# EAGLE schematic Rpi_Interface (EAGLE 9.6.2)
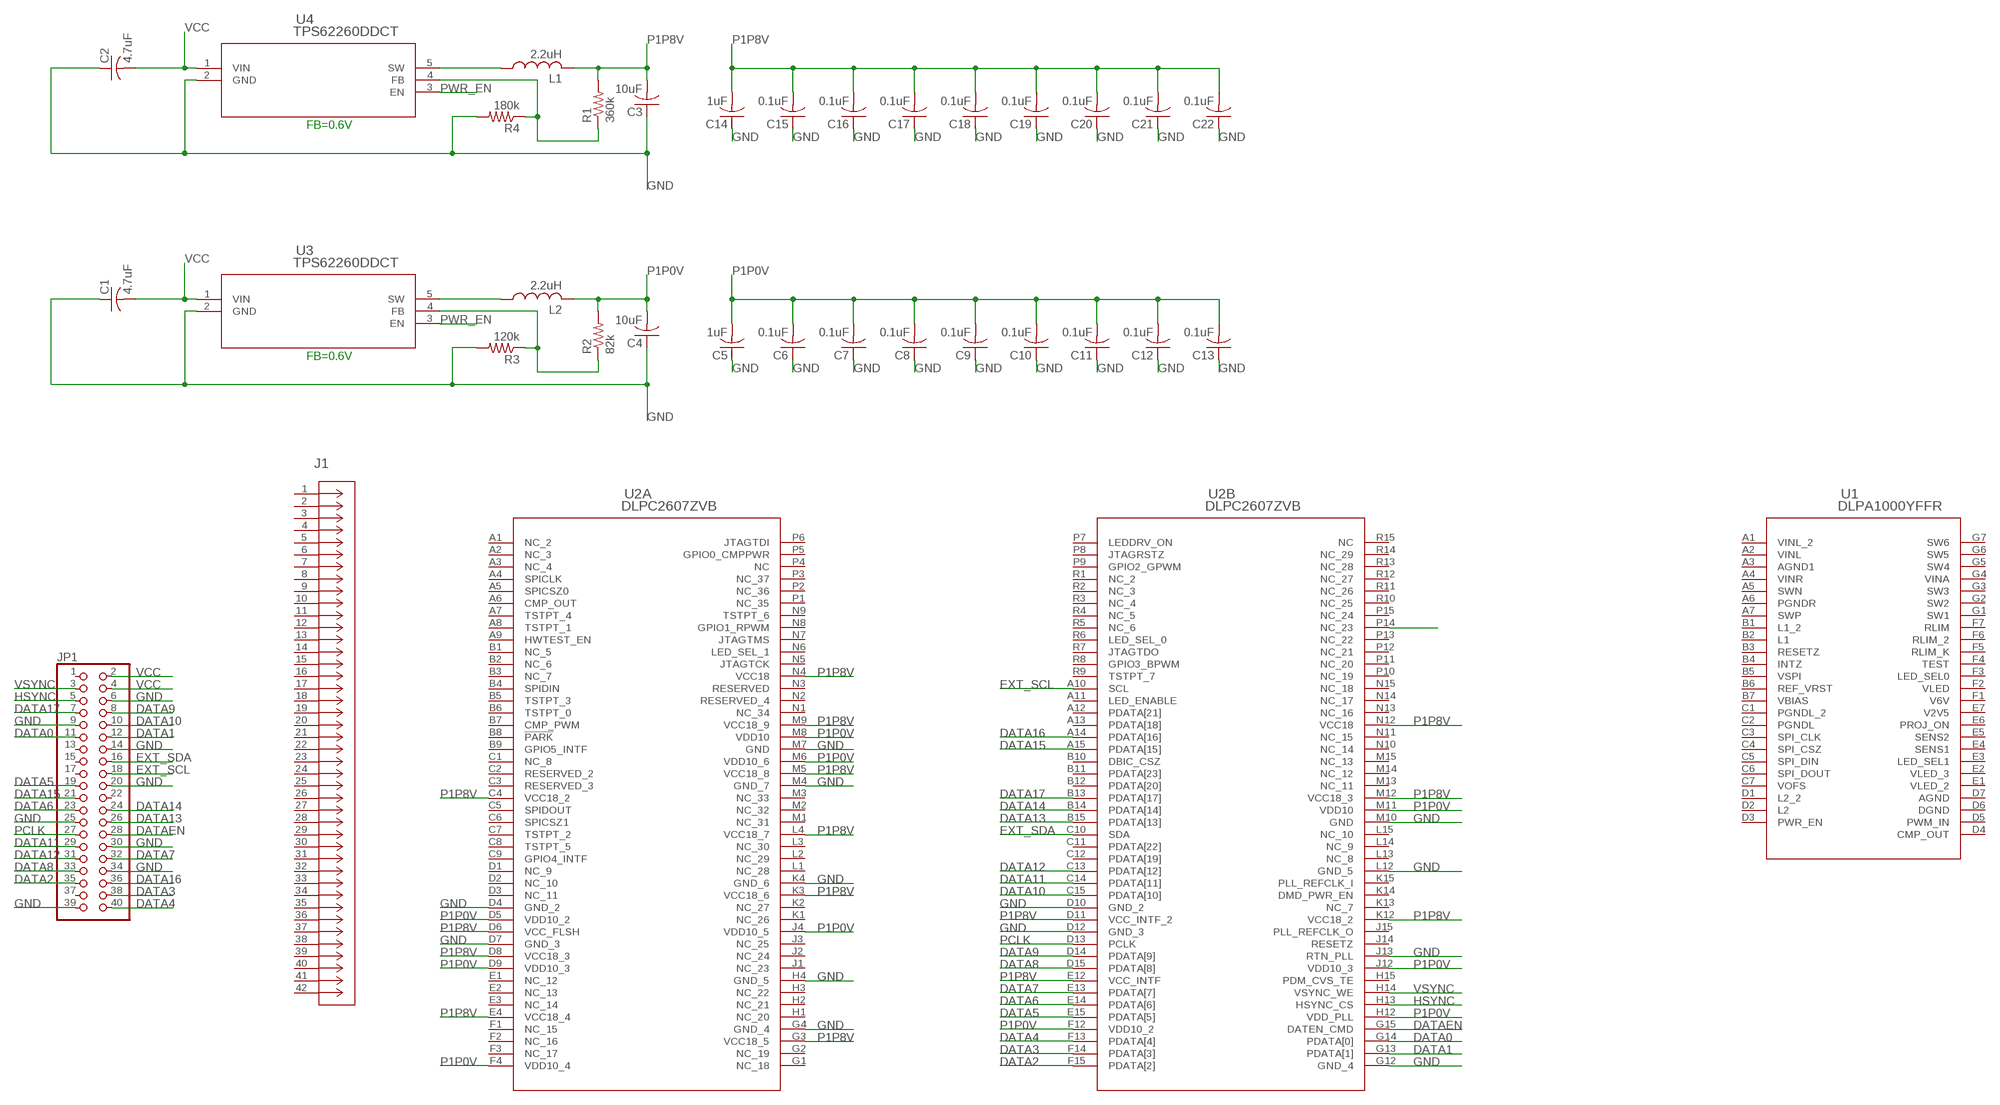
[diagram p0: schematic, sheet 1]

## Parts
C1  4.7uF  C-USC0201  [C0201]
C2  4.7uF  C-USC0201  [C0201]
C3  10uF  C-USC0201  [C0201]
C4  10uF  C-USC0201  [C0201]
C5  1uF  C-USC0201  [C0201]
C6  0.1uF  C-USC0201  [C0201]
C7  0.1uF  C-USC0201  [C0201]
C8  0.1uF  C-USC0201  [C0201]
C9  0.1uF  C-USC0201  [C0201]
C10  0.1uF  C-USC0201  [C0201]
C11  0.1uF  C-USC0201  [C0201]
C12  0.1uF  C-USC0201  [C0201]
C13  0.1uF  C-USC0201  [C0201]
C14  1uF  C-USC0201  [C0201]
C15  0.1uF  C-USC0201  [C0201]
C16  0.1uF  C-USC0201  [C0201]
C17  0.1uF  C-USC0201  [C0201]
C18  0.1uF  C-USC0201  [C0201]
C19  0.1uF  C-USC0201  [C0201]
C20  0.1uF  C-USC0201  [C0201]
C21  0.1uF  C-USC0201  [C0201]
C22  0.1uF  C-USC0201  [C0201]
J1  AXT642124DD1  [CONN_AXT642124_PAN]
JP1  PINHD-2X20  [2X20]
L1  2.2uH  L-USL0201  [L0201]
L2  2.2uH  L-USL0201  [L0201]
R1  360k  R-US_0204/2V  [0204V]
R2  82k  R-US_0204/2V  [0204V]
R3  120k  R-US_0204/2V  [0204V]
R4  180k  R-US_0204/2V  [0204V]
U1  DLPA1000YFFR  [YFF49_TEX]
U2  DLPC2607ZVB  [ZVB176_TEX]
U3  TPS62260DDCT  [DDC5]
U4  TPS62260DDCT  [DDC5]

## Nets
DATA0: JP1.11 U2.G14(B:PDATA[0])
DATA1: JP1.12 U2.G13(B:PDATA[1])
DATA2: JP1.35 U2.F15(B:PDATA[2])
DATA3: JP1.38 U2.F14(B:PDATA[3])
DATA4: JP1.40 U2.F13(B:PDATA[4])
DATA5: JP1.19 U2.E15(B:PDATA[5])
DATA6: JP1.23 U2.E14(B:PDATA[6])
DATA7: JP1.32 U2.E13(B:PDATA[7])
DATA8: JP1.33 U2.D15(B:PDATA[8])
DATA9: JP1.8 U2.D14(B:PDATA[9])
DATA10: JP1.10 U2.C15(B:PDATA[10])
DATA11: JP1.29 U2.C14(B:PDATA[11])
DATA12: JP1.31 U2.C13(B:PDATA[12])
DATA13: JP1.26 U2.B15(B:PDATA[13])
DATA14: JP1.24 U2.B14(B:PDATA[14])
DATA15: JP1.21 U2.A15(B:PDATA[15])
DATA16: JP1.36 U2.A14(B:PDATA[16])
DATA17: JP1.7 U2.B13(B:PDATA[17])
DATAEN: JP1.28 U2.G15(B:DATEN_CMD)
EXT_SCL: JP1.18 U2.A10(B:SCL)
EXT_SDA: JP1.16 U2.C10(B:SDA)
GND: C1.1 C2.1 C3.1 C4.1 C5.1 C6.1 C7.1 C8.1 C9.1 C10.1 C11.1 C12.1 C13.1 C14.1 C15.1 C16.1 C17.1 C18.1 C19.1 C20.1 C21.1 C22.1 JP1.6 JP1.9 JP1.14 JP1.20 JP1.25 JP1.30 JP1.34 JP1.39 R3.2 R4.2 U2.D4(A:GND_2) U2.D7(A:GND_3) U2.D10(B:GND_2) U2.D12(B:GND_3) U2.G4(A:GND_4) U2.G12(B:GND_4) U2.H4(A:GND_5) U2.J13(B:RTN_PLL) U2.K4(A:GND_6) U2.L12(B:GND_5) U2.M4(A:GND_7) U2.M7(A:GND) U2.M10(B:GND) U3.2(GND) U4.2(GND)
HSYNC: JP1.5 U2.H13(B:HSYNC_CS)
N$1: U2.P14(B:NC_23)
N$4: R1.1 R4.1 U4.4(FB)
N$5: L2.1 U3.5(SW)
N$7: L1.1 U4.5(SW)
N$8: R2.1 R3.1 U3.4(FB)
P1P0V: C4.2 C5.2 C6.2 C7.2 C8.2 C9.2 C10.2 C11.2 C12.2 C13.2 L2.2 R2.2 U2.D5(A:VDD10_2) U2.D9(A:VDD10_3) U2.F4(A:VDD10_4) U2.F12(B:VDD10_2) U2.H12(B:VDD_PLL) U2.J4(A:VDD10_5) U2.J12(B:VDD10_3) U2.M6(A:VDD10_6) U2.M8(A:VDD10) U2.M11(B:VDD10)
P1P8V: C3.2 C14.2 C15.2 C16.2 C17.2 C18.2 C19.2 C20.2 C21.2 C22.2 L1.2 R1.2 U2.C4(A:VCC18_2) U2.D6(A:VCC_FLSH) U2.D8(A:VCC18_3) U2.D11(B:VCC_INTF_2) U2.E4(A:VCC18_4) U2.E12(B:VCC_INTF) U2.G3(A:VCC18_5) U2.K3(A:VCC18_6) U2.K12(B:VCC18_2) U2.L4(A:VCC18_7) U2.M5(A:VCC18_8) U2.M9(A:VCC18_9) U2.M12(B:VCC18_3) U2.N4(A:VCC18) U2.N12(B:VCC18)
PCLK: JP1.27 U2.D13(B:PCLK)
PWR_EN: U3.3(EN) U4.3(EN)
VCC: C1.2 C2.2 JP1.2 JP1.4 U3.1(VIN) U4.1(VIN)
VSYNC: JP1.3 U2.H14(B:VSYNC_WE)
Unconnected: J1.1 J1.2 J1.3 J1.4 J1.5 J1.6 J1.7 J1.8 J1.9 J1.10 J1.11 J1.12 J1.13 J1.14 J1.15 J1.16 J1.17 J1.18 J1.19 J1.20 J1.21 J1.22 J1.23 J1.24 J1.25 J1.26 J1.27 J1.28 J1.29 J1.30 J1.31 J1.32 J1.33 J1.34 J1.35 J1.36 J1.37 J1.38 J1.39 J1.40 J1.41 J1.42 JP1.1 JP1.13 JP1.15 JP1.17 JP1.22 JP1.37 U1.A1(VINL_2) U1.A2(VINL) U1.A4(VINR) U1.A5(SWN) U1.A7(SWP) U1.B1(L1_2) U1.B2(L1) U1.B3(RESETZ) U1.B4(INTZ) U1.B6(REF_VRST) U1.B7(VBIAS) U1.C3(SPI_CLK) U1.C4(SPI_CSZ) U1.C5(SPI_DIN) U1.C6(SPI_DOUT) U1.C7(VOFS) U1.D1(L2_2) U1.D2(L2) U1.D3(PWR_EN) U1.D4(CMP_OUT) U1.D5(PWM_IN) U1.E1(VLED_2) U1.E2(VLED_3) U1.E3(LED_SEL1) U1.E4(SENS1) U1.E5(SENS2) U1.E6(PROJ_ON) U1.E7(V2V5) U1.F1(V6V) U1.F2(VLED) U1.F3(LED_SEL0) U1.F4(TEST) U1.F5(RLIM_K) U1.F6(RLIM_2) U1.F7(RLIM) U1.G1(SW1) U1.G2(SW2) U1.G3(SW3) U1.G4(VINA) U1.G5(SW4) U1.G6(SW5) U1.G7(SW6) U2.A1(A:NC_2) U2.A2(A:NC_3) U2.A3(A:NC_4) U2.A4(A:SPICLK) U2.A5(A:SPICSZ0) U2.A6(A:CMP_OUT) U2.A7(A:TSTPT_4) U2.A8(A:TSTPT_1) U2.A9(A:HWTEST_EN) U2.A11(B:LED_ENABLE) U2.A12(B:PDATA[21]) U2.A13(B:PDATA[18]) U2.B1(A:NC_5) U2.B2(A:NC_6) U2.B3(A:NC_7) U2.B4(A:SPIDIN) U2.B5(A:TSTPT_3) U2.B6(A:TSTPT_0) U2.B7(A:CMP_PWM) U2.B8(A:!PARK) U2.B9(A:GPIO5_INTF) U2.B10(B:DBIC_CSZ) U2.B11(B:PDATA[23]) U2.B12(B:PDATA[20]) U2.C1(A:NC_8) U2.C2(A:RESERVED_2) U2.C3(A:RESERVED_3) U2.C5(A:SPIDOUT) U2.C6(A:SPICSZ1) U2.C7(A:TSTPT_2) U2.C8(A:TSTPT_5) U2.C9(A:GPIO4_INTF) U2.C11(B:PDATA[22]) U2.C12(B:PDATA[19]) U2.D1(A:NC_9) U2.D2(A:NC_10) U2.D3(A:NC_11) U2.E1(A:NC_12) U2.E2(A:NC_13) U2.E3(A:NC_14) U2.F1(A:NC_15) U2.F2(A:NC_16) U2.F3(A:NC_17) U2.G1(A:NC_18) U2.G2(A:NC_19) U2.H1(A:NC_20) U2.H2(A:NC_21) U2.H3(A:NC_22) U2.H15(B:PDM_CVS_TE) U2.J1(A:NC_23) U2.J2(A:NC_24) U2.J3(A:NC_25) U2.J14(B:RESETZ) U2.J15(B:PLL_REFCLK_O) U2.K1(A:NC_26) U2.K2(A:NC_27) U2.K13(B:NC_7) U2.K14(B:DMD_PWR_EN) U2.K15(B:PLL_REFCLK_I) U2.L1(A:NC_28) U2.L2(A:NC_29) U2.L3(A:NC_30) U2.L13(B:NC_8) U2.L14(B:NC_9) U2.L15(B:NC_10) U2.M1(A:NC_31) U2.M2(A:NC_32) U2.M3(A:NC_33) U2.M13(B:NC_11) U2.M14(B:NC_12) U2.M15(B:NC_13) U2.N1(A:NC_34) U2.N2(A:RESERVED_4) U2.N3(A:RESERVED) U2.N5(A:JTAGTCK) U2.N6(A:LED_SEL_1) U2.N7(A:JTAGTMS) U2.N8(A:GPIO1_RPWM) U2.N9(A:TSTPT_6) U2.N10(B:NC_14) U2.N11(B:NC_15) U2.N13(B:NC_16) U2.N14(B:NC_17) U2.N15(B:NC_18) U2.P1(A:NC_35) U2.P2(A:NC_36) U2.P3(A:NC_37) U2.P4(A:NC) U2.P5(A:GPIO0_CMPPWR) U2.P6(A:JTAGTDI) U2.P7(B:LEDDRV_ON) U2.P8(B:JTAGRSTZ) U2.P9(B:GPIO2_GPWM) U2.P10(B:NC_19) U2.P11(B:NC_20) U2.P12(B:NC_21) U2.P13(B:NC_22) U2.P15(B:NC_24) U2.R1(B:NC_2) U2.R2(B:NC_3) U2.R3(B:NC_4) U2.R4(B:NC_5) U2.R5(B:NC_6) U2.R6(B:LED_SEL_0) U2.R7(B:JTAGTDO) U2.R8(B:GPIO3_BPWM) U2.R9(B:TSTPT_7) U2.R10(B:NC_25) U2.R11(B:NC_26) U2.R12(B:NC_27) U2.R13(B:NC_28) U2.R14(B:NC_29) U2.R15(B:NC)

## Notes on the sheet
- FB=0.6V
- FB=0.6V

## Power pins joined to a net without a drawn wire
AGND: U1.D7(AGND)
AGND1: U1.A3(AGND1)
DGND: U1.D6(DGND)
PGNDL: U1.C2(PGNDL)
PGNDL_2: U1.C1(PGNDL_2)
PGNDR: U1.A6(PGNDR)
VSPI: U1.B5(VSPI)

## Library data of the parts
C1-C22 = rcl:C-US: CAPACITOR, American symbol; SPICEPREFIX: C
J1 = DLP:AXT642124DD1; BUILT_BY: EMA_Cory; COPYRIGHT: Copyright (C) 2018 Accelerated Designs. All rights reserved; DATASHEET: https://www.mouser.com/datasheet/2/315/con_eng_f4s-1075761.pdf; MANUFACTURER_PART_NUMBER: AXT642124DD1; SOURCELIBRARY: Panasonic_2020-09-29; VENDOR: Panasonic
JP1 = adafruit:PINHD-2X20: PIN HEADER
L1 L2 = rcl:L-US: INDUCTOR, American symbol; SPICEPREFIX: L
R1-R4 = rcl:R-US_: RESISTOR, American symbol; SPICEPREFIX: R
U1 = DLP:DLPA1000YFFR; BUILT_BY: EMA_Jessica; COPYRIGHT: Copyright (C) 2018 Accelerated Designs. All rights reserved; MANUFACTURER_PART_NUMBER: DLPA1000YFFR; SOURCELIBRARY: TI_2019-05-10; VENDOR: Texas Instruments
U2 = DLP:DLPC2607ZVB; BUILT_BY: EMA_UL_Team; MANUFACTURER_PART_NUMBER: DLPC2607ZVB; SOURCELIBRARY: TI_2016-08-12; VENDOR: Texas Instruments
U3 U4 = DLP:TPS62260DDCT; DATASHEET_URL: http://www.ti.com/lit/gpn/TPS62260; DESCRIPTION: 2.25MHz 600mA Step-Down Converter in 2x2mm SON/TSOT23 Package; FAMILY_NAME: STEP-DOWN REGULATOR; GENERIC_PART_NUMBER: TPS62260; INDUSTRY_STD_PKG_TYPE: SOT; MANUFACTURER: Texas Instruments; MANUFACTURER_PART_NUMBER: TPS62260DDCT; PACKAGE_DESIGNATOR: DDC; PIN_COUNT: 5; VENDOR: Texas Instruments